# Altium schematic sheet FPGA_51_Spirit_Level_Tester.SchDoc: LCD Spirit Level Tester
size C; DocumentNumber: 1; SheetNumber: 1; SheetTotal: 3
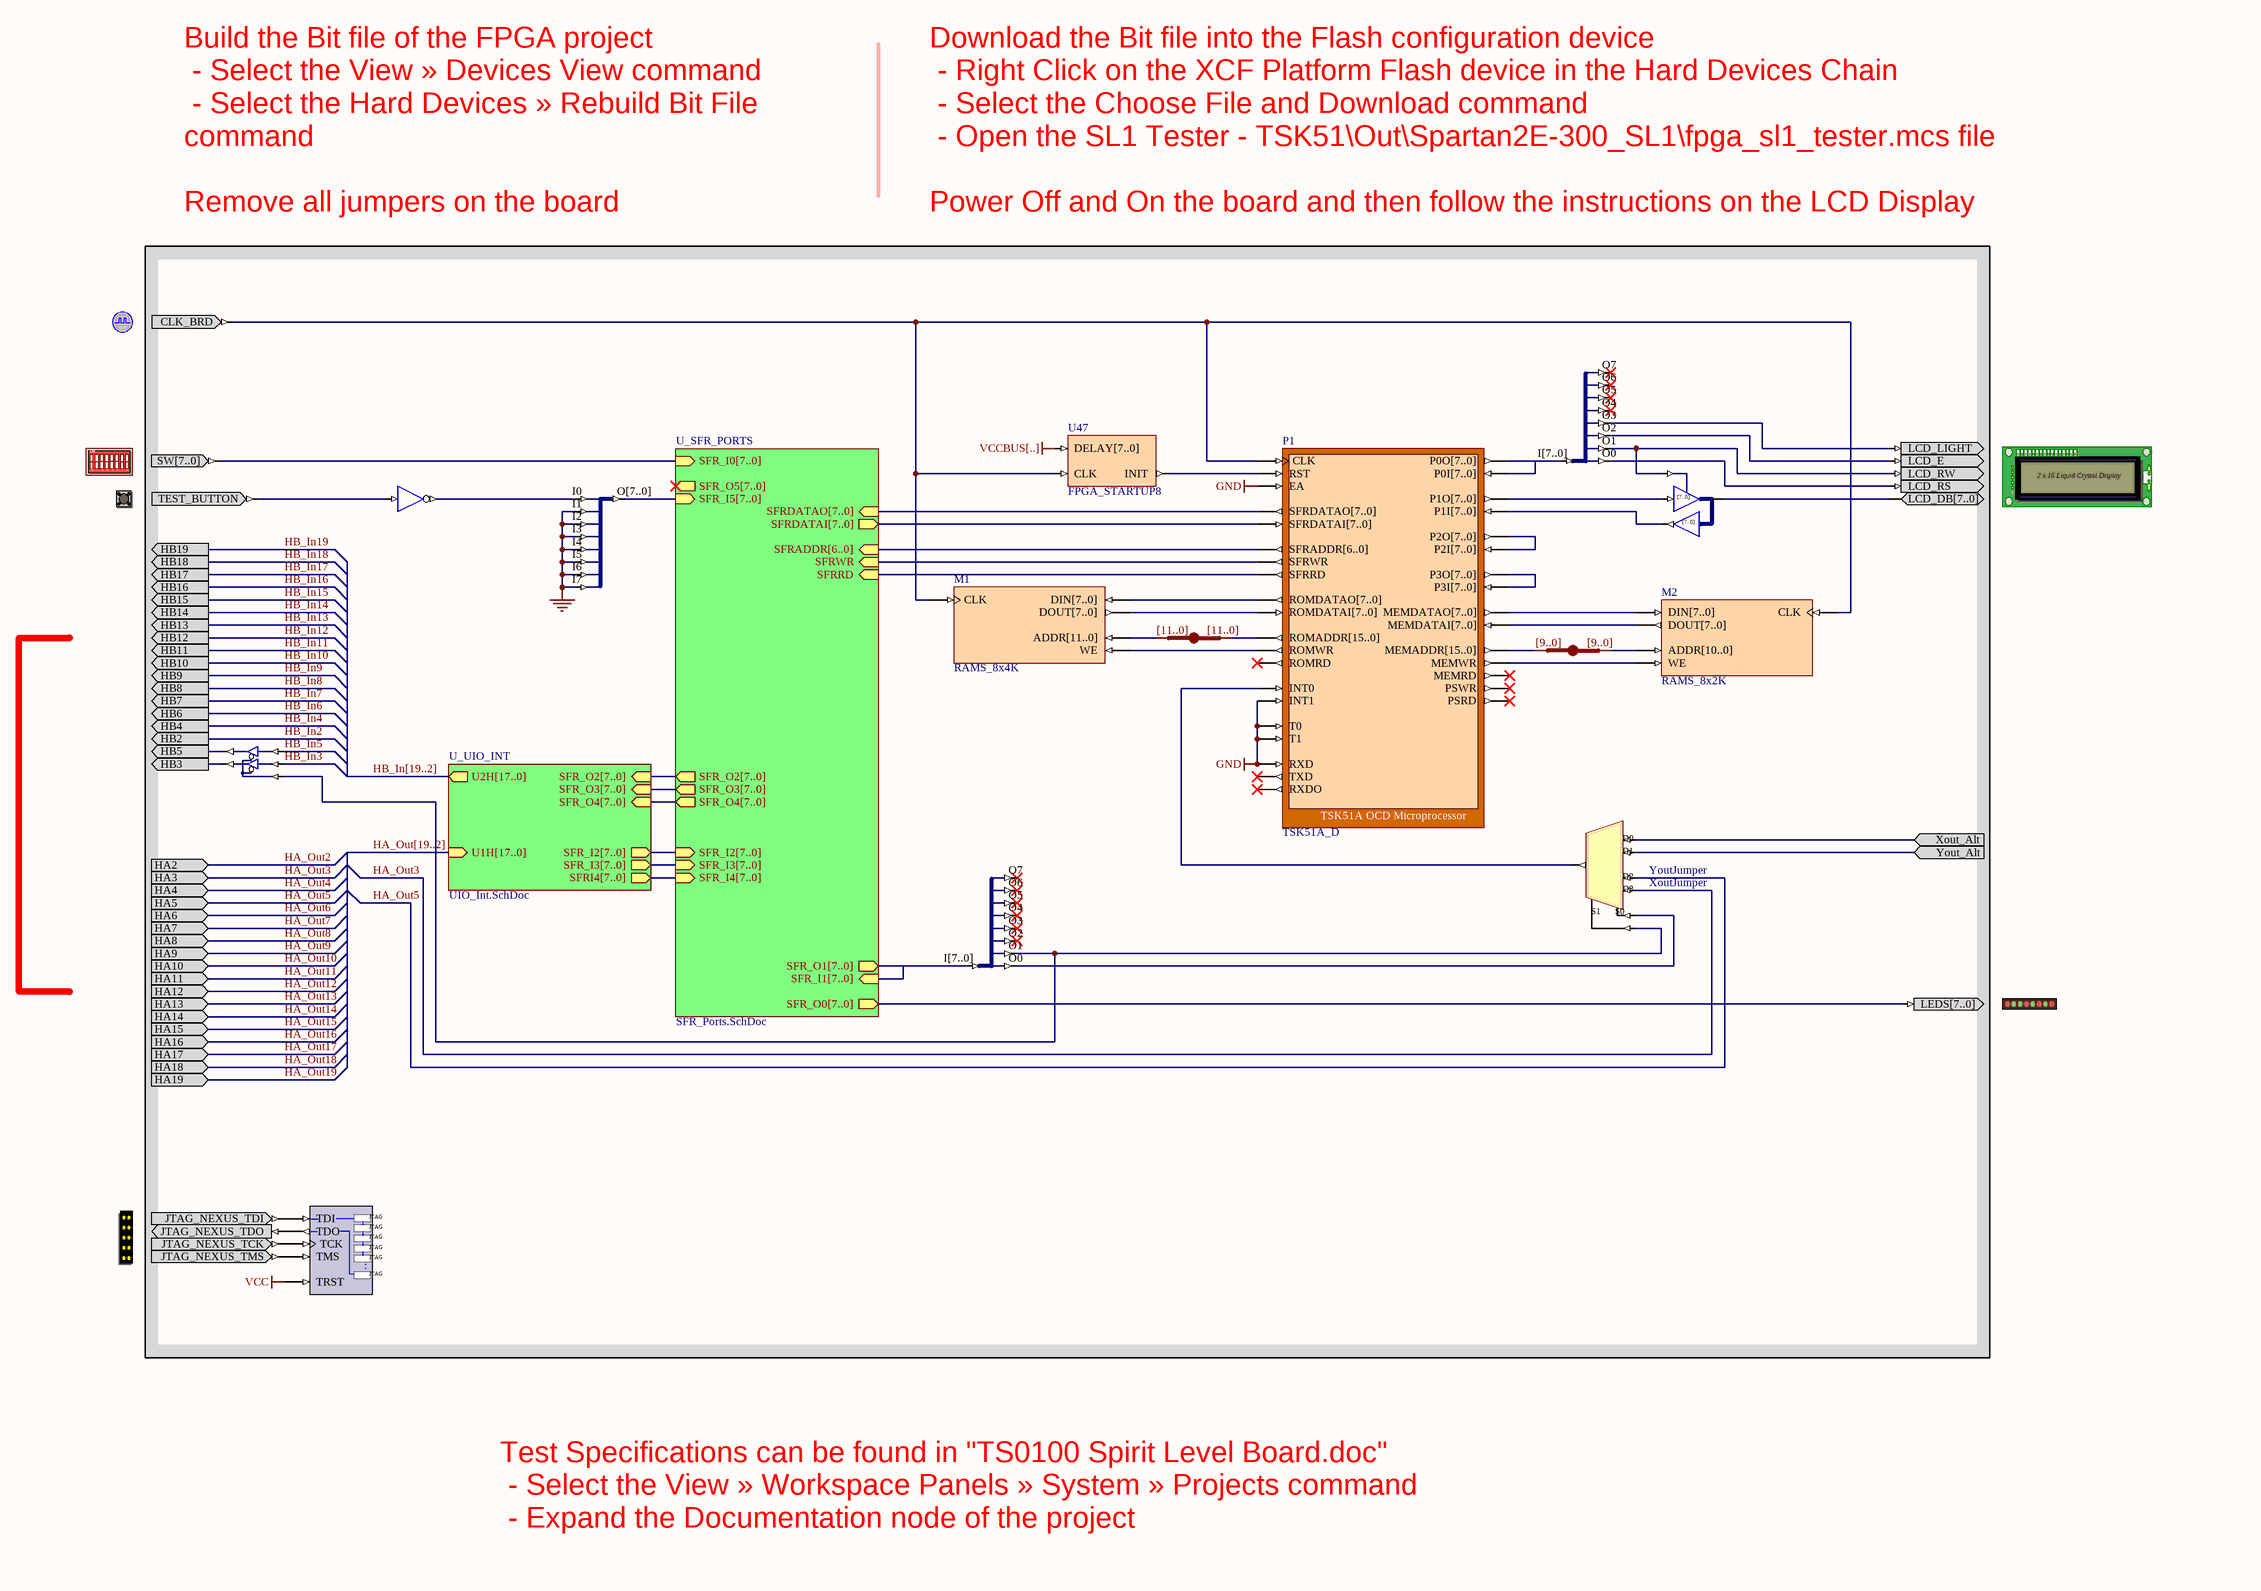
[diagram p0: FPGA_51_Spirit_Level_Tester.SchDoc]

## Parts
(Parts that share a designator on the sheet are numbered #1, #2 ... from top to bottom, then left to right.)
?#1  CLOCK_BOARD  (value not drawn)
?#2  LCD  (value not drawn)
?#3  DIPSWITCH  (value not drawn)
?#4  TEST_BUTTON  (value not drawn)
?#5  LED  (value not drawn)
?#6  NEXUS_JTAG_CONNECTOR  (value not drawn)
JB_S2  IndexA: [11..0]  (hidden comment: JB)
JB_S3  IndexA: [9..0]  (hidden comment: JB)
M1  RAMS_8x4K
M2  RAMS_8x2K
NEXUS_JTAG_PORT  NEXUS_JTAG_PORT  (value not drawn)
P1  TSK51A_D
U31  M1_S4S1  (value not drawn)
U32  J8B_8S  (value not drawn)
U33  BUFT2S  (value not drawn)
U47  FPGA_STARTUP8
U48  IOBUF8B  (value not drawn)
U49  J8B_8S  (value not drawn)
U50  INV  (value not drawn)
U51  J8S_8B  (value not drawn)

## Sub-sheets
U_SFR_PORTS = SFR_Ports.SchDoc: SFRDATAO[7..0] (in), SFRWR (in), SFRDATAI[7..0] (out), SFRRD (in), SFRADDR[6..0] (in), SFR_I0[7..0] (in), SFR_O0[7..0] (out), SFR_I1[7..0] (in), SFR_O1[7..0] (out), SFR_I2[7..0] (in), SFR_O2[7..0] (out), SFR_I3[7..0] (in), SFR_O3[7..0] (out), SFR_I4[7..0] (in), SFR_O4[7..0] (out), SFR_O5[7..0] (out), SFR_I5[7..0] (in)
U_UIO_INT = UIO_Int.SchDoc: U2H[17..0] (out), SFR_I2[7..0] (out), SFR_I3[7..0] (out), SFRI4[7..0] (out), U1H[17..0] (in), SFR_O2[7..0] (in), SFR_O3[7..0] (in), SFR_O4[7..0] (in)

## Ports
HA2 (in), HA3 (in), HA4 (in), HA5 (in), HA6 (in), HA7 (in), HA8 (in), HA9 (in), HA10 (in), HA11 (in), HA12 (in), HA13 (in), HA14 (in), HA15 (in), HA16 (in), HA17 (in), HA18 (in), HA19 (in), HB2 (out), HB3 (out), HB4 (out), HB5 (out), HB6 (out), HB7 (out), HB8 (out), HB9 (out), HB10 (out), HB11 (out), HB12 (out), HB13 (out), HB14 (out), HB15 (out), HB16 (out), HB17 (out), HB18 (out), HB19 (out), Xout_Alt (in), Yout_Alt (in)

## Nets
GND: P1.EA P1.INT1 P1.RXD P1.T0 P1.T1 U51.I1 U51.I2 U51.I3 U51.I4 U51.I5 U51.I6 U51.I7
VCC: NEXUS_JTAG_PORT.TRST
VCCBUS[..]: U47.DELAY[7..0]
HA_Out2: port HA2
HA_Out3: U31.D3 ; port HA3
HA_Out4: port HA4
HA_Out5: U31.D2 ; port HA5
HA_Out6: port HA6
HA_Out7: port HA7
HA_Out8: port HA8
HA_Out9: port HA9
HA_Out10: port HA10
HA_Out11: port HA11
HA_Out12: port HA12
HA_Out13: port HA13
HA_Out14: port HA14
HA_Out15: port HA15
HA_Out16: port HA16
HA_Out17: port HA17
HA_Out18: port HA18
HA_Out19: port HA19
HB3: U33.O0(Y0) ; port HB3
HB5: U33.O1(Y1) ; port HB5
HB_In2: port HB2
HB_In3: U33.I0
HB_In4: port HB4
HB_In5: U33.I1
HB_In6: port HB6
HB_In7: port HB7
HB_In8: port HB8
HB_In9: port HB9
HB_In10: port HB10
HB_In11: port HB11
HB_In12: port HB12
HB_In13: port HB13
HB_In14: port HB14
HB_In15: port HB15
HB_In16: port HB16
HB_In17: port HB17
HB_In18: port HB18
HB_In19: port HB19
Xout_Alt: U31.D0 ; port Xout_Alt
Yout_Alt: U31.D1 ; port Yout_Alt
Net?#1_CLK_BRD: ?#1.CLK_BRD M1.CLK M2.CLK P1.CLK U47.CLK
Net?#2_LCD_DB[7..0]: ?#2.LCD_DB[7..0] U48.IO[7..0]
Net?#2_LCD_E: ?#2.LCD_E U49.O2
Net?#2_LCD_LIGHT: ?#2.LCD_LIGHT U49.O3
Net?#2_LCD_RS: ?#2.LCD_RS U49.O0
Net?#2_LCD_RW: ?#2.LCD_RW U48.T U49.O1
Net?#3_SW[7..0]: ?#3.SW[7..0] ; sheet U_SFR_PORTS/SFR_I0[7..0]
Net?#4_TEST_BUTTON: ?#4.TEST_BUTTON U50.I
Net?#5_LEDS[7..0]: ?#5.LEDS[7..0] ; sheet U_SFR_PORTS/SFR_O0[7..0]
Net?#6_JTAG_NEXUS_TCK: ?#6.JTAG_NEXUS_TCK NEXUS_JTAG_PORT.TCK
Net?#6_JTAG_NEXUS_TDI: ?#6.JTAG_NEXUS_TDI NEXUS_JTAG_PORT.TDI
Net?#6_JTAG_NEXUS_TDO: ?#6.JTAG_NEXUS_TDO NEXUS_JTAG_PORT.TDO
Net?#6_JTAG_NEXUS_TMS: ?#6.JTAG_NEXUS_TMS NEXUS_JTAG_PORT.TMS
NetJB_S2_A[0..0]: JB_S2.A[0..0] M1.ADDR[11..0]
NetJB_S2_B[0..0]: JB_S2.B[0..0] P1.ROMADDR[15..0]
NetJB_S3_A[0..0]: JB_S3.A[0..0] P1.MEMADDR[15..0]
NetJB_S3_B[0..0]: JB_S3.B[0..0] M2.ADDR[10..0]
NetM1_DIN[7..0]: M1.DIN[7..0] P1.ROMDATAO[7..0]
NetM1_DOUT[7..0]: M1.DOUT[7..0] P1.ROMDATAI[7..0]
NetM1_WE: M1.WE P1.ROMWR
NetM2_DIN[7..0]: M2.DIN[7..0] P1.MEMDATAO[7..0]
NetM2_DOUT[7..0]: M2.DOUT[7..0] P1.MEMDATAI[7..0]
NetM2_WE: M2.WE P1.MEMWR
NetP1_INT0: P1.INT0 U31.O
NetP1_P0I[7..0]: P1.P0I[7..0] P1.P0O[7..0] U49.I[7..0]
NetP1_P1I[7..0]: P1.P1I[7..0] U48.O[7..0]
NetP1_P1O[7..0]: P1.P1O[7..0] U48.I[7..0]
NetP1_P2I[7..0]: P1.P2I[7..0] P1.P2O[7..0]
NetP1_P3I[7..0]: P1.P3I[7..0] P1.P3O[7..0]
NetP1_RST: P1.RST U47.INIT
NetP1_SFRADDR[6..0]: P1.SFRADDR[6..0] ; sheet U_SFR_PORTS/SFRADDR[6..0]
NetP1_SFRDATAI[7..0]: P1.SFRDATAI[7..0] ; sheet U_SFR_PORTS/SFRDATAI[7..0]
NetP1_SFRDATAO[7..0]: P1.SFRDATAO[7..0] ; sheet U_SFR_PORTS/SFRDATAO[7..0]
NetP1_SFRRD: P1.SFRRD ; sheet U_SFR_PORTS/SFRRD
NetP1_SFRWR: P1.SFRWR ; sheet U_SFR_PORTS/SFRWR
NetU31_S0: U31.S0 U32.O0
NetU31_S1: U31.S1 U32.O1 U33.T
NetU32_I[7..0]: U32.I[7..0] ; sheet U_SFR_PORTS/SFR_I1[7..0], sheet U_SFR_PORTS/SFR_O1[7..0]
NetU50_O: U50.O U51.I0
NetU51_O[7..0]: U51.O[7..0] ; sheet U_SFR_PORTS/SFR_I5[7..0]

Not connected (* = marked no-connect by the designer): P1 MEMRD* PSRD* PSWR* ROMRD* RXDO* TXD*; U32 O2* O3* O4* O5* O6* O7*; U49 O4* O5* O6* O7*

## Buses and harness runs
bus HA_Out[19..2] = sheet U_UIO_INT/U1H[17..0]
bus HB_In[19..2] = sheet U_UIO_INT/U2H[17..0]
bus sheet U_SFR_PORTS/SFR_I1[7..0] = sheet U_SFR_PORTS/SFR_O1[7..0]
bus sheet U_SFR_PORTS/SFR_I2[7..0] = sheet U_UIO_INT/SFR_I2[7..0]
bus sheet U_SFR_PORTS/SFR_I3[7..0] = sheet U_UIO_INT/SFR_I3[7..0]
bus sheet U_SFR_PORTS/SFR_I4[7..0] = sheet U_UIO_INT/SFRI4[7..0]
bus sheet U_SFR_PORTS/SFR_O2[7..0] = sheet U_UIO_INT/SFR_O2[7..0]
bus sheet U_SFR_PORTS/SFR_O3[7..0] = sheet U_UIO_INT/SFR_O3[7..0]
bus sheet U_SFR_PORTS/SFR_O4[7..0] = sheet U_UIO_INT/SFR_O4[7..0]

## Notes on the sheet
- Build the Bit file of the FPGA project
  - Select the View » Devices View command
  - Select the Hard Devices » Rebuild Bit File command
  Remove all jumpers on the board
- Download the Bit file into the Flash configuration device
  - Right Click on the XCF Platform Flash device in the Hard Devices Chain
  - Select the Choose File and Download command
  - Open the SL1 Tester - TSK51\Out\Spartan2E-300_SL1\fpga_sl1_tester.mcs file
  Power Off and On the board and then follow the instructions on the LCD Display
- (near U31) YoutJumper
- (near U31) XoutJumper
- Test Specifications can be found in "TS0100 Spirit Level Board.doc"
  - Select the View » Workspace Panels » System » Projects command
  - Expand the Documentation node of the project
- Title
- Size:
- Date:
- File:
- C
- Number:
- Time:
- Revision:
- Sheet
- of
- (in symbol DIPSWITCH) ON; 1; 2; 3; 4; 5; 6; 7; 8
- (in symbol IOBUF8B) [7..0]
- (in symbol LCD) 2 x 16 Liquid Crystal Display
- (in symbol NEXUS_JTAG_PORT) JTAG; .

## Library data of the parts
?#1 = CLOCK_BOARD: Global System Clock Supply; PortComponent: True; Published: 19-Nov-2003; Publisher: Altium Limited
?#2 = LCD: Liquid Crystal Display; PortComponent: True; Published: 19-Nov-2003; Publisher: Altium Limited
?#3 = DIPSWITCH: 8-Way Dip Switch; PortComponent: True; Published: 19-Nov-2003; Publisher: Altium Limited
?#4 = TEST_BUTTON: Test Button; PortComponent: True; Published: 19-Nov-2003; Publisher: Altium Limited
?#5 = LED: 8-Way LEDS; PortComponent: True; Published: 19-Nov-2003; Publisher: Altium Limited
?#6 = NEXUS_JTAG_CONNECTOR: JTAG Port; PortComponent: True; Published: 19-Nov-2003; Publisher: Altium Limited
JB_S2 JB_S3 = JB: System BUS Joiner; Published: 29-Jan-2004; Publisher: Altium Limited; FunctionalClass: Bus Joiner; HelpURL: CR0118 FPGA Generic Library Guide.pdf#page=296; LastRevisionNo: 1.00.00
  JB_S2: IndexB: [11..0]
  JB_S3: IndexB: [9..0]
M1 = RAMS_8x4K: Single Port RAM; Memory_Depth: 4096; Memory_Type: RAM_SinglePortBlock; Memory_Width: 8; Memory_ClockEdge: Rising; Nexus_Core: Memory_Program; Memory_EnablePin: False; Published: 11/10/2004; Publisher: Altium Hobart Technology Center; Memory_ByteWrites: False
M2 = RAMS_8x2K: Single Port RAM; Memory_Depth: 2048; Memory_Type: RAM_SinglePortBlock; Memory_Width: 8; Memory_ClockEdge: Rising; Nexus_Core: Memory_Program; Memory_EnablePin: False; Published: 11/10/2004; Publisher: Altium Hobart Technology Center; Memory_ByteWrites: False
NEXUS_JTAG_PORT = NEXUS_JTAG_PORT: Soft Nexus-Chain Connector; NEXUS_JTAG_CONNECTOR: True; VHDLIB_SIM: GENERIC_LIB; Published: 29-Jan-2004; Publisher: Altium Limited
P1 = TSK51A_D: TSK51A OCD Microprocessor; NEXUS_CORE: Processor_OCDS; NEXUS_JTAG_DEVICE: True; NEXUS_JTAG_ORDER: 0; ChildModel1: RAM256x8_TSK51D; ChildCore1: M1; Published: 17-Nov-2004; Publisher: Altium Limited; ComponentLink1Description: Core &Resource Usage; ComponentLink1URL: CR0140 FPGA Processor Resource Usage.pdf#page=3; ComponentLink2Description: Embedded &Tools Guide; ComponentLink2URL: GU0107 Using the TSK51x TSK52x Embedded Tools.pdf; ComponentLink3Description: Embedded T&echnical References; ComponentLink3URL: TR0105 TSK51x TSK52x Embedded Tools Reference.pdf; HelpURL: CR0115 TSK51x MCU.pdf#page=3; LastRevisionNo: 1.00.00
U31 = M1_S4S1: 4x1-Single Wire to 1x1-Single Wire Multiplexer; SubClass: SnS1; PortSize: 1; PortStyle: Single Pin Version; ArchiveName: GENERIC; VHDLIB_SIM: GENERIC_LIB; Published: 29-Jan-2004; Publisher: Altium Limited; LastRevisionNo: 1.00.00; HelpURL: CR0118 FPGA Generic Library Guide.pdf#page=364; ComponentLink1URL: CR0137 FPGA Multiplexer Resource Usage.pdf#page=52; ComponentLink1Description: Core &Resource Usage; FunctionalClass: Multiplexer
U32 U49 = J8B_8S: 8-Bit input bus to 8 single pin outputs; ArchiveName: GENERIC; VHDLIB_SIM: GENERIC_LIB; FunctionalClass: Bus Joiner; PortSize: 8; Published: 29-Jan-2004; Publisher: Altium Limited; ComponentLink1Description: Core &Resource Usage; ComponentLink1URL: CR0126 FPGA Bus Joiner Resource Usage.pdf#page=27; HelpURL: CR0118 FPGA Generic Library Guide.pdf#page=303; LastRevisionNo: 1.00.00
U33 = BUFT2S: 2-Bit 3-state Buffer with Active Low Enable, Single Pin Version; SubClass: BUFT; PortSize: 2; ArchiveName: GENERIC; VHDLIB_SIM: GENERIC_LIB; Published: 29-Jan-2004; Publisher: Altium Limited; LastRevisionNo: 1.00.00; HelpURL: CR0118 FPGA Generic Library Guide.pdf#page=125; ComponentLink1URL: CR0125 FPGA Buffer Resource Usage.pdf#page=55; ComponentLink1Description: Core &Resource Usage; FunctionalClass: Buffer; Enable: Low; PortStyle: Single Pin Version
U47 = FPGA_STARTUP8: FPGA Startup With 8 Bit Delay; Published: 9-Dec-2004; Publisher: Altium Limited; ComponentLink1Description: Core &Resource Usage; ComponentLink1URL: CR0139 FPGA Peripheral Resource Usage.pdf#page=9; HelpURL: CR0119 FPGA_STARTUPx Powerup Delay Unit.pdf#page=2; LastRevisionNo: 1.00.00
U48 = IOBUF8B: 8-Bit Input/Output Buffer, Bus Version; ArchiveName: GENERIC; VHDLIB_SIM: GENERIC_LIB; Control: Common Control T; Enable: Low; PortSize: 8; SubClass: IOBUF; Published: 29-Jan-2004; Publisher: Altium Limited; ComponentLink1Description: Core &Resource Usage; ComponentLink1URL: CR0125 FPGA Buffer Resource Usage.pdf#page=87; FunctionalClass: Buffer; HelpURL: CR0118 FPGA Generic Library Guide.pdf#page=292; LastRevisionNo: 1.00.00; PortStyle: Bus Version
U50 = INV: Inverter; FunctionalClass: Logic Primitive; ArchiveName: GENERIC; VHDLIB_SIM: GENERIC_LIB; Published: 29-Jan-2004; Publisher: Altium Limited; XilinxEquivalent: INV; LastRevisionNo: 1.00.00; HelpURL: CR0118 FPGA Generic Library Guide.pdf#page=290; ComponentLink1URL: CR0136 FPGA Logic Primitive Resource Usage.pdf#page=61; ComponentLink1Description: Core &Resource Usage; SubClass: INV
U51 = J8S_8B: 8 Single pin inputs to single 8-Bit output bus; FunctionalClass: Bus Joiner; PortSize: 8; ArchiveName: GENERIC; VHDLIB_SIM: GENERIC_LIB; Published: 29-Jan-2004; Publisher: Altium Limited; LastRevisionNo: 1.00.00; HelpURL: CR0118 FPGA Generic Library Guide.pdf#page=305; ComponentLink1URL: CR0126 FPGA Bus Joiner Resource Usage.pdf#page=28; ComponentLink1Description: Core &Resource Usage